# Altium schematic sheet DualHBridge.SchDoc
size A4; SheetNumber: 1; SheetTotal: 1
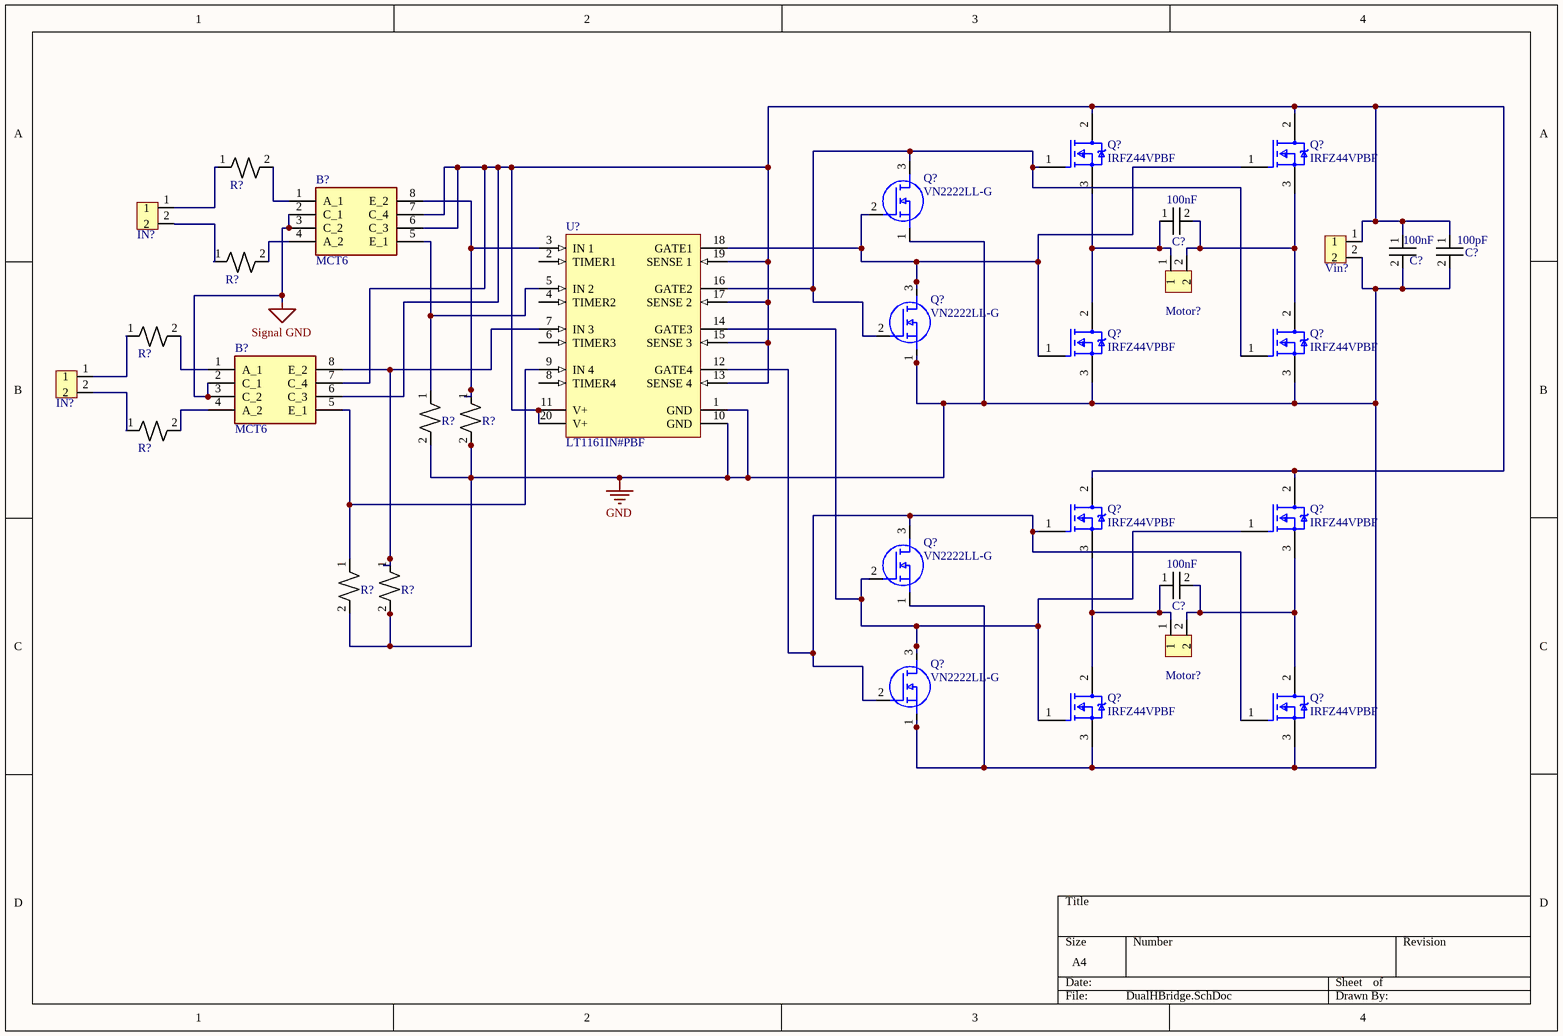
[diagram p0: DualHBridge.SchDoc]

## Parts
(Parts that share a designator on the sheet are numbered #1, #2 ... from top to bottom, then left to right.)
B?#1  MCT6  [DIP762W56P254L977H381Q8N]
B?#2  MCT6  [DIP762W56P254L977H381Q8N]
C?#1  100nF  [Capacitor]
C?#2  100nF  [Capacitor]
C?#3  100pF  [Capacitor]
C?#4  100nF  [Capacitor]
IN?#1  Header  [SHDR2W64P0X250_1X2_740X575X700P]  (value not drawn)
IN?#2  Header  [SHDR2W64P0X250_1X2_740X575X700P]  (value not drawn)
Motor?#1  Header  [SHDR2W64P0X250_1X2_740X575X700P]  (value not drawn)
Motor?#2  Header  [SHDR2W64P0X250_1X2_740X575X700P]  (value not drawn)
Q?#1  IRFZ44VPBF  [FP-PG-TO220-3-MFG]
Q?#2  IRFZ44VPBF  [FP-PG-TO220-3-MFG]
Q?#3  VN2222LL-G  [VN2222LLG]
Q?#4  VN2222LL-G  [VN2222LLG]
Q?#5  IRFZ44VPBF  [FP-PG-TO220-3-MFG]
Q?#6  IRFZ44VPBF  [FP-PG-TO220-3-MFG]
Q?#7  IRFZ44VPBF  [FP-PG-TO220-3-MFG]
Q?#8  IRFZ44VPBF  [FP-PG-TO220-3-MFG]
Q?#9  VN2222LL-G  [VN2222LLG]
Q?#10  VN2222LL-G  [VN2222LLG]
Q?#11  IRFZ44VPBF  [FP-PG-TO220-3-MFG]
Q?#12  IRFZ44VPBF  [FP-PG-TO220-3-MFG]
R?#1  Resistor 330R +/-5 % 0402 63 mW  [Resistor]  (value not drawn)
R?#2  Resistor 330R +/-5 % 0402 63 mW  [Resistor]  (value not drawn)
R?#3  Resistor 330R +/-5 % 0402 63 mW  [Resistor]  (value not drawn)
R?#4  Resistor 1k +/-1% 1206 250 mW  [Resistor]  (value not drawn)
R?#5  Resistor 1k +/-1% 1206 250 mW  [Resistor]  (value not drawn)
R?#6  Resistor 330R +/-5 % 0402 63 mW  [Resistor]  (value not drawn)
R?#7  Resistor 1k +/-1% 1206 250 mW  [Resistor]  (value not drawn)
R?#8  Resistor 1k +/-1% 1206 250 mW  [Resistor]  (value not drawn)
U?  LT1161IN#PBF  [LT-N-20]
Vin?  Header  [SHDR2W64P0X250_1X2_740X575X700P]  (value not drawn)

## Nets
GND: C?#2.2 C?#3.2 Q?#3.1(S) Q?#4.1(S) Q?#5.3(SOURCE) Q?#6.3(SOURCE) Q?#9.1(S) Q?#10.1(S) Q?#11.3(SOURCE) Q?#12.3(SOURCE) R?#4.2 R?#5.2 R?#7.2 R?#8.2 U?.1(GND) U?.10(GND) Vin?.2
Signal GND: B?#1.2(C_1) B?#1.3(C_2) B?#2.2(C_1) B?#2.3(C_2)
NetB?#1_1: B?#1.1(A_1) R?#1.2
NetB?#1_4: B?#1.4(A_2) R?#2.2
NetB?#1_5: B?#1.5(E_1) R?#4.1 U?.5(IN_2)
NetB?#1_6: B?#1.6(C_3) B?#1.7(C_4) B?#2.6(C_3) B?#2.7(C_4) C?#2.1 C?#3.1 Q?#1.2(DRAIN) Q?#2.2(DRAIN) Q?#7.2(DRAIN) Q?#8.2(DRAIN) U?.11(V+) U?.13(SENSE_4) U?.15(SENSE_3) U?.17(SENSE_2) U?.19(SENSE_1) U?.20(V+) Vin?.1
NetB?#1_8: B?#1.8(E_2) R?#5.1 U?.3(IN_1)
NetB?#2_1: B?#2.1(A_1) R?#3.2
NetB?#2_4: B?#2.4(A_2) R?#6.2
NetB?#2_5: B?#2.5(E_1) R?#7.1 U?.9(IN_4)
NetB?#2_8: B?#2.8(E_2) R?#8.1 U?.7(IN_3)
NetC?#1_1: C?#1.1 Motor?#1.1 Q?#1.3(SOURCE) Q?#5.2(DRAIN)
NetC?#1_2: C?#1.2 Motor?#1.2 Q?#2.3(SOURCE) Q?#6.2(DRAIN)
NetC?#4_1: C?#4.1 Motor?#2.1 Q?#7.3(SOURCE) Q?#11.2(DRAIN)
NetC?#4_2: C?#4.2 Motor?#2.2 Q?#8.3(SOURCE) Q?#12.2(DRAIN)
NetIN?#1_1: IN?#1.1 R?#1.1
NetIN?#1_2: IN?#1.2 R?#2.1
NetIN?#2_1: IN?#2.1 R?#3.1
NetIN?#2_2: IN?#2.2 R?#6.1
NetQ?#1_1: Q?#1.1(GATE) Q?#3.3(D) Q?#4.2(G) Q?#6.1(GATE) U?.16(GATE2)
NetQ?#2_1: Q?#2.1(GATE) Q?#3.2(G) Q?#4.3(D) Q?#5.1(GATE) U?.18(GATE1)
NetQ?#7_1: Q?#7.1(GATE) Q?#9.3(D) Q?#10.2(G) Q?#12.1(GATE) U?.12(GATE4)
NetQ?#8_1: Q?#8.1(GATE) Q?#9.2(G) Q?#10.3(D) Q?#11.1(GATE) U?.14(GATE3)

Not connected (* = marked no-connect by the designer): U? 2(TIMER1) 4(TIMER2) 6(TIMER3) 8(TIMER4)

## Library data of the parts
B?#1 B?#2 = MCT6: Vishay, MCT6 DC Input Phototransistor Output Optocoupler, Through Hole, 8-Pin DIP; Geometry.Height: 3.81mm; Manufacturer_Name: Vishay; Manufacturer_Part_Number: MCT6; Mouser Part Number: 782-MCT6; Mouser Price/Stock: https://www.mouser.co.uk/ProductDetail/Vishay-Semiconductors/MCT6?qs=BUVUY%2Fo3jYXL%252B4Q07h%252BWzw%3D%3D; Arrow Part Number: MCT6; Arrow Price/Stock: https://www.arrow.com/en/products/mct6/vishay?region=nac; Datasheet Link: http://www.vishay.com/docs/83645/mct6.pdf
C?#1-C?#4 = Capacitor
Q?#1 Q?#2 Q?#5-Q?#8 Q?#11 Q?#12 = CMP-32901-001154-1: MOSFET N-CH 60V 55A TO220AB; Polarization: N; Power Dissipation: 115W; Rds On Max: 16.5mR; Gate to Source Voltage (Vgs): 20V; Threshold Voltage: 4V; Turn-On Delay Time: 13ns; Element Configuration: Single; Input Capacitance: 1.812nF; Turn-Off Delay Time: 40ns; Mount: Through Hole; Drain to Source Voltage (Vdss): 60V; Max Dual Supply Voltage: 60V; Length: 0.42inch; Height: 0.65inch; Width: 0.19inch; Packaging: Rail/Tube; Halogen Free: Halogen Free; Number of Pins: 3; Continuous Drain Current (ID): 55A; Drain to Source Resistance: 16.5mR; Series: HEXFET®; RoHS Compliant: Yes; Reach SVHC Compliant: Yes; Drain to Source Breakdown Voltage: 60V; Max Operating Temperature: 175°C; Case/Package: TO-220; Max Power Dissipation: 115W; Lead Free: Lead Free; Min Operating Temperature: -55°C
Q?#3 Q?#4 Q?#9 Q?#10 = VN2222LL-G: Microchip VN2222LL-G N-channel MOSFET Transistor, 0.23 A, 60 V, 3-Pin TO-92; Geometry.Height: 5.334mm; Manufacturer_Name: Microchip; Manufacturer_Part_Number: VN2222LL-G; Mouser Part Number: 689-VN2222LL-G; Mouser Price/Stock: https://www.mouser.co.uk/ProductDetail/Microchip-Technology/VN2222LL-G?qs=H6g4Fy%252BsDGemwmUTAFka1Q%3D%3D; Arrow Part Number: VN2222LL-G; Arrow Price/Stock: https://www.arrow.com/en/products/vn2222ll-g/microchip-technology?region=europe; Datasheet Link: http://www.microchip.com/mymicrochip/filehandler.aspx?ddocname=en571446
R?#1-R?#8 = Resistor
U? = CMP-0479-00309-1: Quad Protected High-Side MOSFET Driver, 8 to 48 V Vin, 20-pin DIP (N-20), -40 to 85 degC, Pb-Free; Manufacturer: Linear Technology; ComponentLink3URL: http://cds.linear.com/docs/en/packaging/05081510_I_N20.pdf; DatasheetVersion: Rev. A; ComponentLink3Description: Package Specification; ComponentLink1Description: Manufacturer URL; PackageVersion: Rev. I, 07/2011; ComponentLink1URL: http://www.linear.com/; PartNumber: LT1161IN#PBF; RoHS: TRUE; ComponentLink2Description: Datasheet; PackageDescription: 20-Pin PDIP, Body 26.924 x 6.477 mm, Pitch 2.54 mm; PackageReference: N-20; Mounting Technology: Through Hole; ComponentLink2URL: http://cds.linear.com/docs/en/datasheet/1161fa.pdf